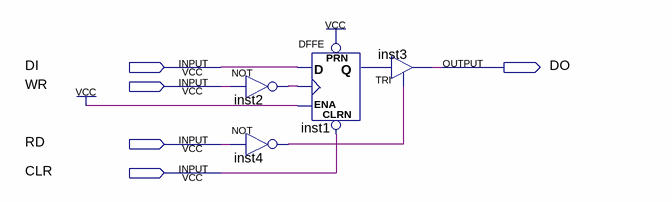
[diagram p0: schematic sheet]
// Quartus schematic MU_1Bit_dffe.bdf as structural Verilog: 4 symbols, 5 pins
module MU_1Bit_dffe (
  input  DI,
  input  WR,
  input  RD,
  input  CLR,
  output DO
);

  wire inst1_q, inst2_out, inst4_out;

  not inst2 (inst2_out, WR);
  not inst4 (inst4_out, RD);
  DFFE inst1 (.PRN(1'b1), .CLRN(CLR), .D(DI), .CLK(inst2_out), .ENA(1'b1), .Q(inst1_q));
  TRI inst3 (.IN(inst1_q), .OE(inst4_out), .OUT(DO));
endmodule
